# EAGLE design driver (EAGLE 9.6.1)
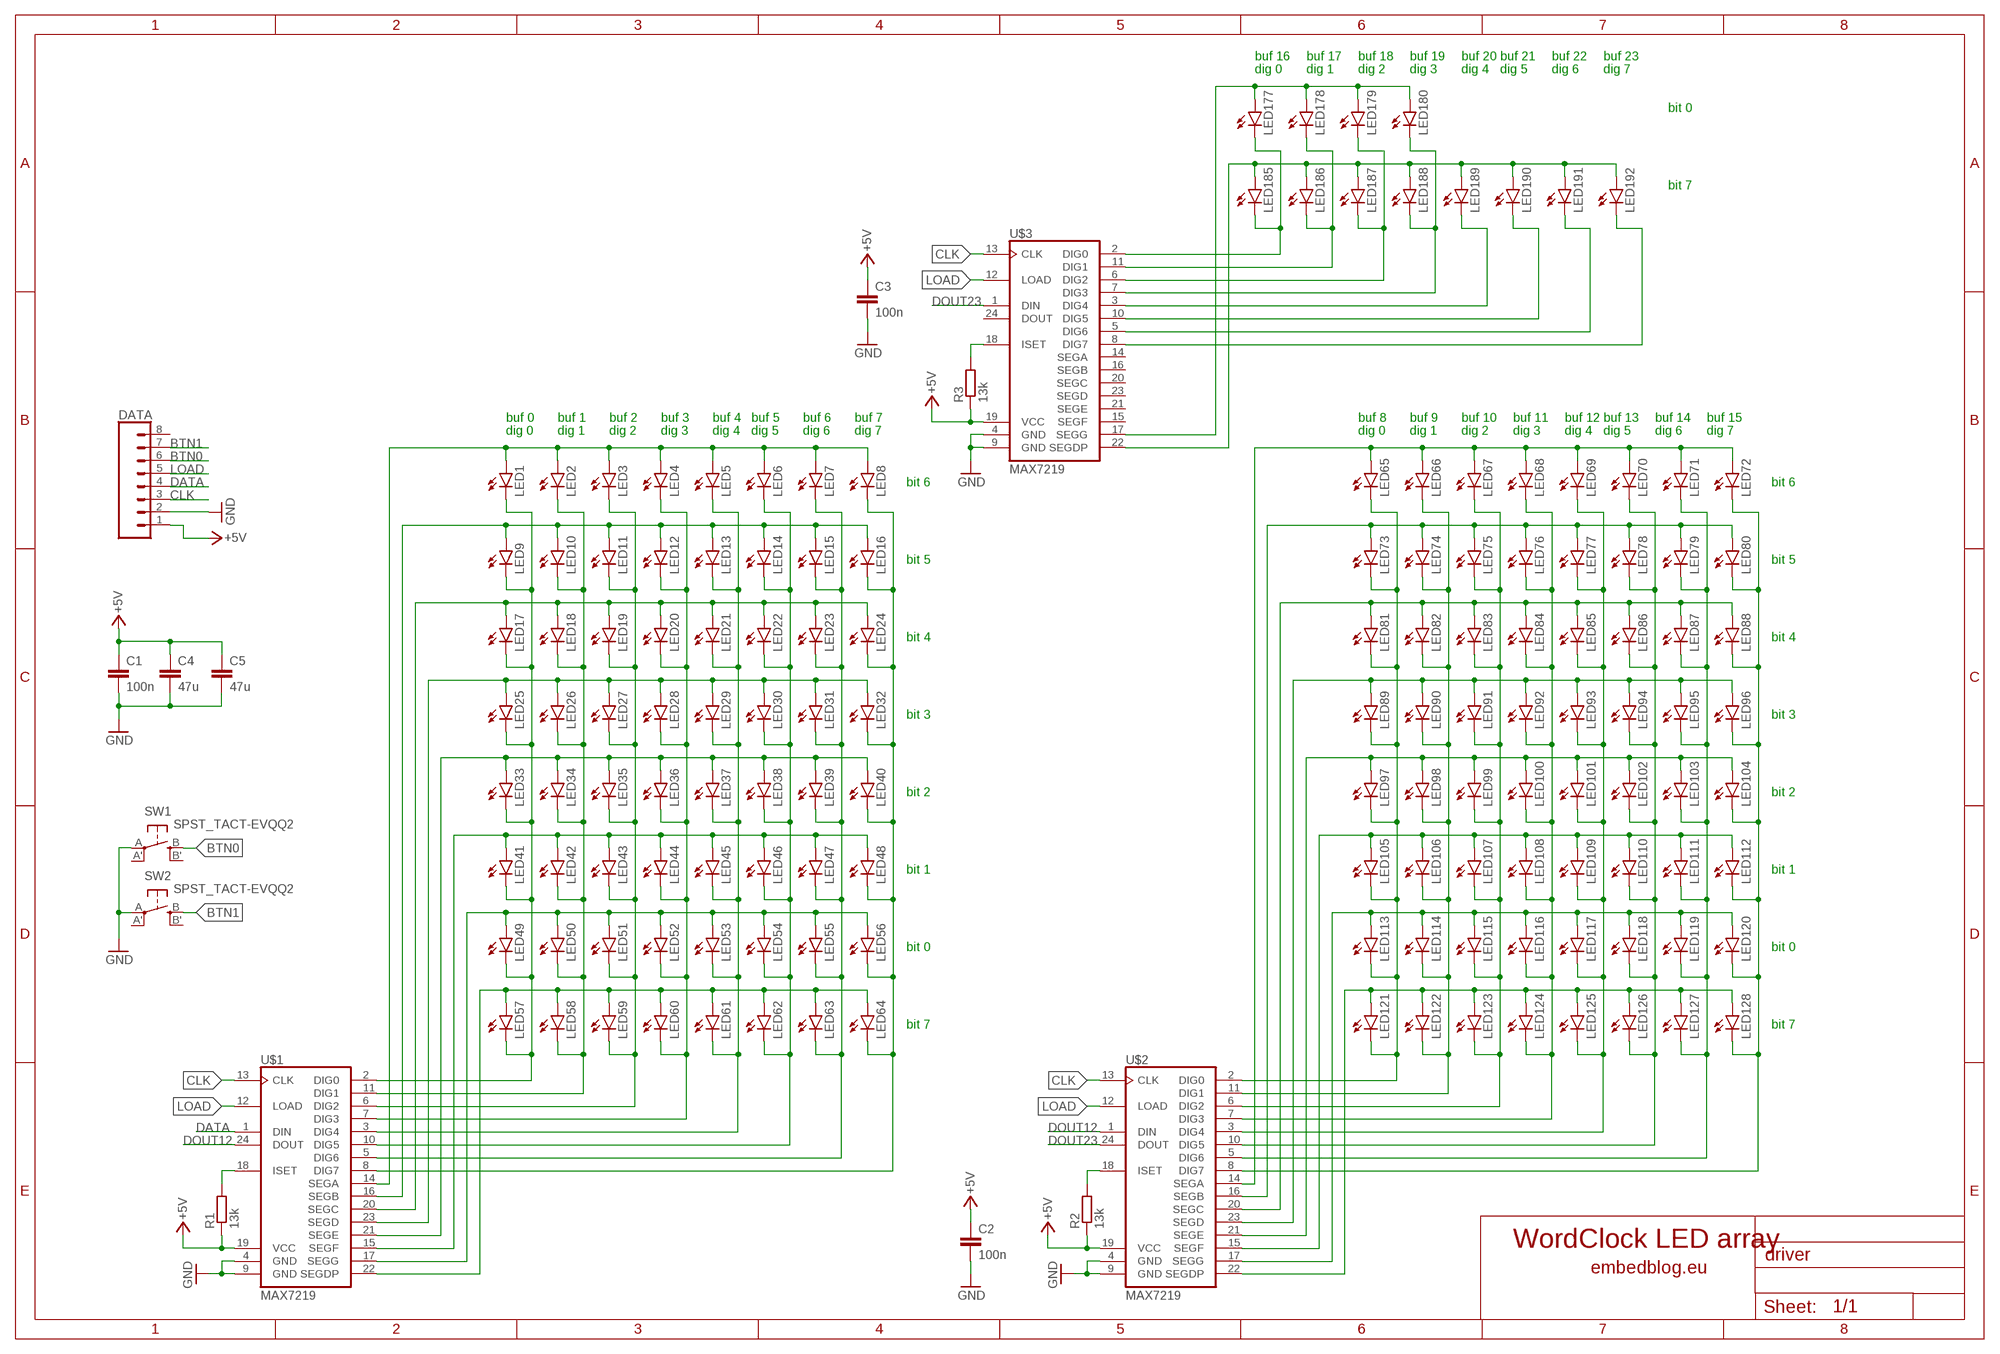
[diagram p0: schematic, sheet 1]

## Parts
C1  100n  C-EUC1206  [C1206]
C2  100n  C-EUC1206  [C1206]
C3  100n  C-EUC1206  [C1206]
C4  47u  C-EUC1206  [C1206]
C5  47u  C-EUC1206  [C1206]
DATA  CONN_08"  [1X08]
LED1  LEDCHIPLED_1206  [CHIPLED_1206]
LED2  LEDCHIPLED_1206  [CHIPLED_1206]
LED3  LEDCHIPLED_1206  [CHIPLED_1206]
LED4  LEDCHIPLED_1206  [CHIPLED_1206]
LED5  LEDCHIPLED_1206  [CHIPLED_1206]
LED6  LEDCHIPLED_1206  [CHIPLED_1206]
LED7  LEDCHIPLED_1206  [CHIPLED_1206]
LED8  LEDCHIPLED_1206  [CHIPLED_1206]
LED9  LEDCHIPLED_1206  [CHIPLED_1206]
LED10  LEDCHIPLED_1206  [CHIPLED_1206]
LED11  LEDCHIPLED_1206  [CHIPLED_1206]
LED12  LEDCHIPLED_1206  [CHIPLED_1206]
LED13  LEDCHIPLED_1206  [CHIPLED_1206]
LED14  LEDCHIPLED_1206  [CHIPLED_1206]
LED15  LEDCHIPLED_1206  [CHIPLED_1206]
LED16  LEDCHIPLED_1206  [CHIPLED_1206]
LED17  LEDCHIPLED_1206  [CHIPLED_1206]
LED18  LEDCHIPLED_1206  [CHIPLED_1206]
LED19  LEDCHIPLED_1206  [CHIPLED_1206]
LED20  LEDCHIPLED_1206  [CHIPLED_1206]
LED21  LEDCHIPLED_1206  [CHIPLED_1206]
LED22  LEDCHIPLED_1206  [CHIPLED_1206]
LED23  LEDCHIPLED_1206  [CHIPLED_1206]
LED24  LEDCHIPLED_1206  [CHIPLED_1206]
LED25  LEDCHIPLED_1206  [CHIPLED_1206]
LED26  LEDCHIPLED_1206  [CHIPLED_1206]
LED27  LEDCHIPLED_1206  [CHIPLED_1206]
LED28  LEDCHIPLED_1206  [CHIPLED_1206]
LED29  LEDCHIPLED_1206  [CHIPLED_1206]
LED30  LEDCHIPLED_1206  [CHIPLED_1206]
LED31  LEDCHIPLED_1206  [CHIPLED_1206]
LED32  LEDCHIPLED_1206  [CHIPLED_1206]
LED33  LEDCHIPLED_1206  [CHIPLED_1206]
LED34  LEDCHIPLED_1206  [CHIPLED_1206]
LED35  LEDCHIPLED_1206  [CHIPLED_1206]
LED36  LEDCHIPLED_1206  [CHIPLED_1206]
LED37  LEDCHIPLED_1206  [CHIPLED_1206]
LED38  LEDCHIPLED_1206  [CHIPLED_1206]
LED39  LEDCHIPLED_1206  [CHIPLED_1206]
LED40  LEDCHIPLED_1206  [CHIPLED_1206]
LED41  LEDCHIPLED_1206  [CHIPLED_1206]
LED42  LEDCHIPLED_1206  [CHIPLED_1206]
LED43  LEDCHIPLED_1206  [CHIPLED_1206]
LED44  LEDCHIPLED_1206  [CHIPLED_1206]
LED45  LEDCHIPLED_1206  [CHIPLED_1206]
LED46  LEDCHIPLED_1206  [CHIPLED_1206]
LED47  LEDCHIPLED_1206  [CHIPLED_1206]
LED48  LEDCHIPLED_1206  [CHIPLED_1206]
LED49  LEDCHIPLED_1206  [CHIPLED_1206]
LED50  LEDCHIPLED_1206  [CHIPLED_1206]
LED51  LEDCHIPLED_1206  [CHIPLED_1206]
LED52  LEDCHIPLED_1206  [CHIPLED_1206]
LED53  LEDCHIPLED_1206  [CHIPLED_1206]
LED54  LEDCHIPLED_1206  [CHIPLED_1206]
LED55  LEDCHIPLED_1206  [CHIPLED_1206]
LED56  LEDCHIPLED_1206  [CHIPLED_1206]
LED57  LEDCHIPLED_1206  [CHIPLED_1206]
LED58  LEDCHIPLED_1206  [CHIPLED_1206]
LED59  LEDCHIPLED_1206  [CHIPLED_1206]
LED60  LEDCHIPLED_1206  [CHIPLED_1206]
LED61  LEDCHIPLED_1206  [CHIPLED_1206]
LED62  LEDCHIPLED_1206  [CHIPLED_1206]
LED63  LEDCHIPLED_1206  [CHIPLED_1206]
LED64  LEDCHIPLED_1206  [CHIPLED_1206]
LED65  LEDCHIPLED_1206  [CHIPLED_1206]
LED66  LEDCHIPLED_1206  [CHIPLED_1206]
LED67  LEDCHIPLED_1206  [CHIPLED_1206]
LED68  LEDCHIPLED_1206  [CHIPLED_1206]
LED69  LEDCHIPLED_1206  [CHIPLED_1206]
LED70  LEDCHIPLED_1206  [CHIPLED_1206]
LED71  LEDCHIPLED_1206  [CHIPLED_1206]
LED72  LEDCHIPLED_1206  [CHIPLED_1206]
LED73  LEDCHIPLED_1206  [CHIPLED_1206]
LED74  LEDCHIPLED_1206  [CHIPLED_1206]
LED75  LEDCHIPLED_1206  [CHIPLED_1206]
LED76  LEDCHIPLED_1206  [CHIPLED_1206]
LED77  LEDCHIPLED_1206  [CHIPLED_1206]
LED78  LEDCHIPLED_1206  [CHIPLED_1206]
LED79  LEDCHIPLED_1206  [CHIPLED_1206]
LED80  LEDCHIPLED_1206  [CHIPLED_1206]
LED81  LEDCHIPLED_1206  [CHIPLED_1206]
LED82  LEDCHIPLED_1206  [CHIPLED_1206]
LED83  LEDCHIPLED_1206  [CHIPLED_1206]
LED84  LEDCHIPLED_1206  [CHIPLED_1206]
LED85  LEDCHIPLED_1206  [CHIPLED_1206]
LED86  LEDCHIPLED_1206  [CHIPLED_1206]
LED87  LEDCHIPLED_1206  [CHIPLED_1206]
LED88  LEDCHIPLED_1206  [CHIPLED_1206]
LED89  LEDCHIPLED_1206  [CHIPLED_1206]
LED90  LEDCHIPLED_1206  [CHIPLED_1206]
LED91  LEDCHIPLED_1206  [CHIPLED_1206]
LED92  LEDCHIPLED_1206  [CHIPLED_1206]
LED93  LEDCHIPLED_1206  [CHIPLED_1206]
LED94  LEDCHIPLED_1206  [CHIPLED_1206]
LED95  LEDCHIPLED_1206  [CHIPLED_1206]
LED96  LEDCHIPLED_1206  [CHIPLED_1206]
LED97  LEDCHIPLED_1206  [CHIPLED_1206]
LED98  LEDCHIPLED_1206  [CHIPLED_1206]
LED99  LEDCHIPLED_1206  [CHIPLED_1206]
LED100  LEDCHIPLED_1206  [CHIPLED_1206]
LED101  LEDCHIPLED_1206  [CHIPLED_1206]
LED102  LEDCHIPLED_1206  [CHIPLED_1206]
LED103  LEDCHIPLED_1206  [CHIPLED_1206]
LED104  LEDCHIPLED_1206  [CHIPLED_1206]
LED105  LEDCHIPLED_1206  [CHIPLED_1206]
LED106  LEDCHIPLED_1206  [CHIPLED_1206]
LED107  LEDCHIPLED_1206  [CHIPLED_1206]
LED108  LEDCHIPLED_1206  [CHIPLED_1206]
LED109  LEDCHIPLED_1206  [CHIPLED_1206]
LED110  LEDCHIPLED_1206  [CHIPLED_1206]
LED111  LEDCHIPLED_1206  [CHIPLED_1206]
LED112  LEDCHIPLED_1206  [CHIPLED_1206]
LED113  LEDCHIPLED_1206  [CHIPLED_1206]
LED114  LEDCHIPLED_1206  [CHIPLED_1206]
LED115  LEDCHIPLED_1206  [CHIPLED_1206]
LED116  LEDCHIPLED_1206  [CHIPLED_1206]
LED117  LEDCHIPLED_1206  [CHIPLED_1206]
LED118  LEDCHIPLED_1206  [CHIPLED_1206]
LED119  LEDCHIPLED_1206  [CHIPLED_1206]
LED120  LEDCHIPLED_1206  [CHIPLED_1206]
LED121  LEDCHIPLED_1206  [CHIPLED_1206]
LED122  LEDCHIPLED_1206  [CHIPLED_1206]
LED123  LEDCHIPLED_1206  [CHIPLED_1206]
LED124  LEDCHIPLED_1206  [CHIPLED_1206]
LED125  LEDCHIPLED_1206  [CHIPLED_1206]
LED126  LEDCHIPLED_1206  [CHIPLED_1206]
LED127  LEDCHIPLED_1206  [CHIPLED_1206]
LED128  LEDCHIPLED_1206  [CHIPLED_1206]
LED177  LEDCHIPLED_1206  [CHIPLED_1206]
LED178  LEDCHIPLED_1206  [CHIPLED_1206]
LED179  LEDCHIPLED_1206  [CHIPLED_1206]
LED180  LEDCHIPLED_1206  [CHIPLED_1206]
LED185  LEDCHIPLED_1206  [CHIPLED_1206]
LED186  LEDCHIPLED_1206  [CHIPLED_1206]
LED187  LEDCHIPLED_1206  [CHIPLED_1206]
LED188  LEDCHIPLED_1206  [CHIPLED_1206]
LED189  LEDCHIPLED_1206  [CHIPLED_1206]
LED190  LEDCHIPLED_1206  [CHIPLED_1206]
LED191  LEDCHIPLED_1206  [CHIPLED_1206]
LED192  LEDCHIPLED_1206  [CHIPLED_1206]
R1  13k  R-EU_R1206  [R1206]
R2  13k  R-EU_R1206  [R1206]
R3  13k  R-EU_R1206  [R1206]
SW1  SPST_TACT-EVQQ2  [EVQ-Q2]
SW2  SPST_TACT-EVQQ2  [EVQ-Q2]
U$1  MAX7219  [SO24W]
U$2  MAX7219  [SO24W]
U$3  MAX7219  [SO24W]

## Nets
+5V: C1.1 C2.1 C3.1 C4.1 C5.1 DATA.1 R1.1 R2.1 R3.1 U$1.19(VCC) U$2.19(VCC) U$3.19(VCC)
BTN0: DATA.6 SW1.B(S)
BTN1: DATA.7 SW2.B(S)
CLK: DATA.3 U$1.13(CLK) U$2.13(CLK) U$3.13(CLK)
DATA: DATA.4 U$1.1(DIN)
DOUT12: U$1.24(DOUT) U$2.1(DIN)
DOUT23: U$2.24(DOUT) U$3.1(DIN)
GND: C1.2 C2.2 C3.2 C4.2 C5.2 DATA.2 SW1.A(P) SW2.A(P) U$1.4(GND) U$1.9(GND) U$2.4(GND) U$2.9(GND) U$3.4(GND) U$3.9(GND)
LOAD: DATA.5 U$1.12(LOAD) U$2.12(LOAD) U$3.12(LOAD)
N$1: LED1.A LED2.A LED3.A LED4.A LED5.A LED6.A LED7.A LED8.A U$1.14(SEGA)
N$2: LED25.A LED26.A LED27.A LED28.A LED29.A LED30.A LED31.A LED32.A U$1.23(SEGD)
N$3: LED9.A LED10.A LED11.A LED12.A LED13.A LED14.A LED15.A LED16.A U$1.16(SEGB)
N$4: LED17.A LED18.A LED19.A LED20.A LED21.A LED22.A LED23.A LED24.A U$1.20(SEGC)
N$5: LED33.A LED34.A LED35.A LED36.A LED37.A LED38.A LED39.A LED40.A U$1.21(SEGE)
N$6: LED41.A LED42.A LED43.A LED44.A LED45.A LED46.A LED47.A LED48.A U$1.15(SEGF)
N$7: LED49.A LED50.A LED51.A LED52.A LED53.A LED54.A LED55.A LED56.A U$1.17(SEGG)
N$8: LED57.A LED58.A LED59.A LED60.A LED61.A LED62.A LED63.A LED64.A U$1.22(SEGDP)
N$9: LED1.C LED9.C LED17.C LED25.C LED33.C LED41.C LED49.C LED57.C U$1.2(DIG0)
N$10: R1.2 U$1.18(ISET)
N$11: LED65.A LED66.A LED67.A LED68.A LED69.A LED70.A LED71.A LED72.A U$2.14(SEGA)
N$12: LED73.A LED74.A LED75.A LED76.A LED77.A LED78.A LED79.A LED80.A U$2.16(SEGB)
N$13: LED81.A LED82.A LED83.A LED84.A LED85.A LED86.A LED87.A LED88.A U$2.20(SEGC)
N$14: LED89.A LED90.A LED91.A LED92.A LED93.A LED94.A LED95.A LED96.A U$2.23(SEGD)
N$15: LED97.A LED98.A LED99.A LED100.A LED101.A LED102.A LED103.A LED104.A U$2.21(SEGE)
N$16: LED105.A LED106.A LED107.A LED108.A LED109.A LED110.A LED111.A LED112.A U$2.15(SEGF)
N$17: LED2.C LED10.C LED18.C LED26.C LED34.C LED42.C LED50.C LED58.C U$1.11(DIG1)
N$18: LED113.A LED114.A LED115.A LED116.A LED117.A LED118.A LED119.A LED120.A U$2.17(SEGG)
N$19: LED121.A LED122.A LED123.A LED124.A LED125.A LED126.A LED127.A LED128.A U$2.22(SEGDP)
N$20: LED65.C LED73.C LED81.C LED89.C LED97.C LED105.C LED113.C LED121.C U$2.2(DIG0)
N$21: LED66.C LED74.C LED82.C LED90.C LED98.C LED106.C LED114.C LED122.C U$2.11(DIG1)
N$22: LED67.C LED75.C LED83.C LED91.C LED99.C LED107.C LED115.C LED123.C U$2.6(DIG2)
N$23: LED68.C LED76.C LED84.C LED92.C LED100.C LED108.C LED116.C LED124.C U$2.7(DIG3)
N$24: LED69.C LED77.C LED85.C LED93.C LED101.C LED109.C LED117.C LED125.C U$2.3(DIG4)
N$25: LED3.C LED11.C LED19.C LED27.C LED35.C LED43.C LED51.C LED59.C U$1.6(DIG2)
N$26: LED70.C LED78.C LED86.C LED94.C LED102.C LED110.C LED118.C LED126.C U$2.10(DIG5)
N$27: LED71.C LED79.C LED87.C LED95.C LED103.C LED111.C LED119.C LED127.C U$2.5(DIG6)
N$28: LED72.C LED80.C LED88.C LED96.C LED104.C LED112.C LED120.C LED128.C U$2.8(DIG7)
N$29: R2.2 U$2.18(ISET)
N$33: LED4.C LED12.C LED20.C LED28.C LED36.C LED44.C LED52.C LED60.C U$1.7(DIG3)
N$37: LED177.A LED178.A LED179.A LED180.A U$3.17(SEGG)
N$38: LED185.A LED186.A LED187.A LED188.A LED189.A LED190.A LED191.A LED192.A U$3.22(SEGDP)
N$39: LED177.C LED185.C U$3.2(DIG0)
N$40: LED178.C LED186.C U$3.11(DIG1)
N$41: LED5.C LED13.C LED21.C LED29.C LED37.C LED45.C LED53.C LED61.C U$1.3(DIG4)
N$42: LED179.C LED187.C U$3.6(DIG2)
N$43: LED180.C LED188.C U$3.7(DIG3)
N$44: LED189.C U$3.3(DIG4)
N$45: LED190.C U$3.10(DIG5)
N$46: LED191.C U$3.5(DIG6)
N$47: LED192.C U$3.8(DIG7)
N$48: R3.2 U$3.18(ISET)
N$49: LED6.C LED14.C LED22.C LED30.C LED38.C LED46.C LED54.C LED62.C U$1.10(DIG5)
N$57: LED7.C LED15.C LED23.C LED31.C LED39.C LED47.C LED55.C LED63.C U$1.5(DIG6)
N$65: LED8.C LED16.C LED24.C LED32.C LED40.C LED48.C LED56.C LED64.C U$1.8(DIG7)
Unconnected: DATA.8 SW1.A'(P1) SW1.B'(S1) SW2.A'(P1) SW2.B'(S1) U$3.14(SEGA) U$3.15(SEGF) U$3.16(SEGB) U$3.20(SEGC) U$3.21(SEGE) U$3.23(SEGD) U$3.24(DOUT)

## Notes on the sheet
- buf 16 | buf 17 | buf 18 | buf 19 | buf 20 | buf 21 | buf 22 | buf 23
- dig 0 | dig 1 | dig 2 | dig 3 | dig 4 | dig 5 | dig 6 | dig 7
- bit 0
- bit 7
- buf 0 | buf 1 | buf 2 | buf 3 | buf 4 | buf 5 | buf 6 | buf 7 | buf 8 | buf 9 | buf 10 | buf 11 | buf 12 | buf 13 | buf 14 | buf 15
- dig 0 | dig 1 | dig 2 | dig 3 | dig 4 | dig 5 | dig 6 | dig 7 | dig 0 | dig 1 | dig 2 | dig 3 | dig 4 | dig 5 | dig 6 | dig 7
- bit 6 | bit 6
- bit 5 | bit 5
- bit 4 | bit 4
- bit 3 | bit 3
- bit 2 | bit 2
- bit 1 | bit 1
- bit 0 | bit 0
- bit 7 | bit 7
- WordClock LED array
- embedblog.eu

## Library data of the parts
C1-C5 = resistor:C-EU: CAPACITOR, European symbol
DATA = SparkFun-Connectors:CONN_08: Multi connection point. Often used as Generic Header-pin footprint for 0.1 inch spaced/style header connections On any of the 0.1 inch spaced packages, you can populate with these: Break Away Headers - Straight <https://www.sparkfun.com/products/116> (PRT-00116) Break Away Male Headers - Right Angle <https://www.sparkfun.com/products/553> (PRT-00553) Female Headers <https://www.sparkfun.com/products/115> (PRT-00115) Break Away Headers - Machine Pin <https://www.sparkfun.com/products/117> (PRT-00117) Break Away Female Headers - Swiss Machine Pin <https://www.sparkfun.com/products/743> (PRT-00743) Arduino Stackable Header - 8 Pin <https://www.sparkfun.com/products/9279> (PRT-09279) For SCREWTERMINALS and SPRING TERMINALS visit here: Screw Terimnals on SparkFun.com <https://www.sparkfun.com/search/results?term=Screw+Terminals> (5mm/3.5mm/2.54mm spacing) This device is also useful as a general connection point to wire up your design to another part of your project. Our various solder wires solder well into these plated through hole pads. Hook-Up Wire - Assortment (Stranded, 22 AWG) <https://www.sparkfun.com/products/11375> (PRT-11375) Hook-Up Wire - Assortment (Solid Core, 22 AWG) <https://www.sparkfun.com/products/11367> (PRT-11367) View the entire wire category on our website here <https://www.sparkfun.com/categories/141> Special notes: Molex polarized connector foot print use with SKU : PRT-08231 with associated crimp pins and housings. 1MM SMD Version SKU: PRT-10208 NOTES ON THE VARIANTS LOCK and LOCK_LONGPADS... This footprint was designed to help hold the alignment of a through-hole component (i.e. 6-pin header) while soldering it into place. You may notice that each hole has been shifted either up or down by 0.005 of an inch from it's more standard position (which is a perfectly straight line). This slight alteration caused the pins (the squares in the middle) to touch the edges of the holes. Because they are alternating, it causes a "brace" to hold the component in place. 0.005 has proven to be the perfect amount of "off-center" position when using our standard breakaway headers. Although looks a little odd when you look at the bare footprint, once you have a header in there, the alteration is very hard to notice. Also,if you push a header all the way into place, it is covered up entirely on the bottom side.; PROD_ID: CONN-08438
LED1-LED128 LED177-LED180 LED185-LED192 = led:LED: LED OSRAM: - CHIPLED LG R971, LG N971, LY N971, LG Q971, LY Q971, LO R971, LY R971 LH N974, LH R974 LS Q976, LO Q976, LY Q976 LO Q996 - Hyper CHIPLED LW Q18S LB Q993, LB Q99A, LB R99A - SideLED LS A670, LO A670, LY A670, LG A670, LP A670 LB A673, LV A673, LT A673, LW A673 LH A674 LY A675 LS A676, LA A676, LO A676, LY A676, LW A676 LS A679, LY A679, LG A679 - Hyper Micro SIDELED® LS Y876, LA Y876, LO Y876, LY Y876 LT Y87S - SmartLED LW L88C, LW L88S LB L89C, LB L89S, LG L890 LS L89K, LO L89K, LY L89K LS L896, LA L896, LO L896, LY L896 - TOPLED LS T670, LO T670, LY T670, LG T670, LP T670 LSG T670, LSP T670, LSY T670, LOP T670, LYG T670 LG T671, LOG T671, LSG T671 LB T673, LV T673, LT T673, LW T673 LH T674 LS T676, LA T676, LO T676, LY T676, LB T676, LH T676, LSB T676, LW T676 LB T67C, LV T67C, LT T67C, LS T67K, LO T67K, LY T67K, LW E67C LS E67B, LA E67B, LO E67B, LY E67B, LB E67C, LV E67C, LT E67C LW T67C LS T679, LY T679, LG T679 LS T770, LO T770, LY T770, LG T770, LP T770 LB T773, LV T773, LT T773, LW T773 LH T774 LS E675, LA E675, LY E675, LS T675 LS T776, LA T776, LO T776, LY T776, LB T776 LHGB T686 LT T68C, LB T68C - Hyper Mini TOPLED® LB M676 - Mini TOPLED Santana® LG M470 LS M47K, LO M47K, LY M47K Source: http://www.osram.convergy.de LUXEON: - LUMILED® LXK2-PW12-R00, LXK2-PW12-S00, LXK2-PW14-U00, LXK2-PW14-V00 LXK2-PM12-R00, LXK2-PM12-S00, LXK2-PM14-U00 LXK2-PE12-Q00, LXK2-PE12-R00, LXK2-PE12-S00, LXK2-PE14-T00, LXK2-PE14-U00 LXK2-PB12-K00, LXK2-PB12-L00, LXK2-PB12-M00, LXK2-PB14-N00, LXK2-PB14-P00, LXK2-PB14-Q00 LXK2-PR12-L00, LXK2-PR12-M00, LXK2-PR14-Q00, LXK2-PR14-R00 LXK2-PD12-Q00, LXK2-PD12-R00, LXK2-PD12-S00 LXK2-PH12-R00, LXK2-PH12-S00 LXK2-PL12-P00, LXK2-PL12-Q00, LXK2-PL12-R00 Source: www.luxeon.com KINGBRIGHT: KA-3528ASYC Source: www.kingbright.com
R1-R3 = resistor:R-EU_: RESISTOR, European symbol
SW1 SW2 = adafruit:SPST_TACT: SMT 6mm switch, EVQQ2 series http://www.ladyada.net/library/eagle
U$1-U$3 = custom:MAX7219

## Board
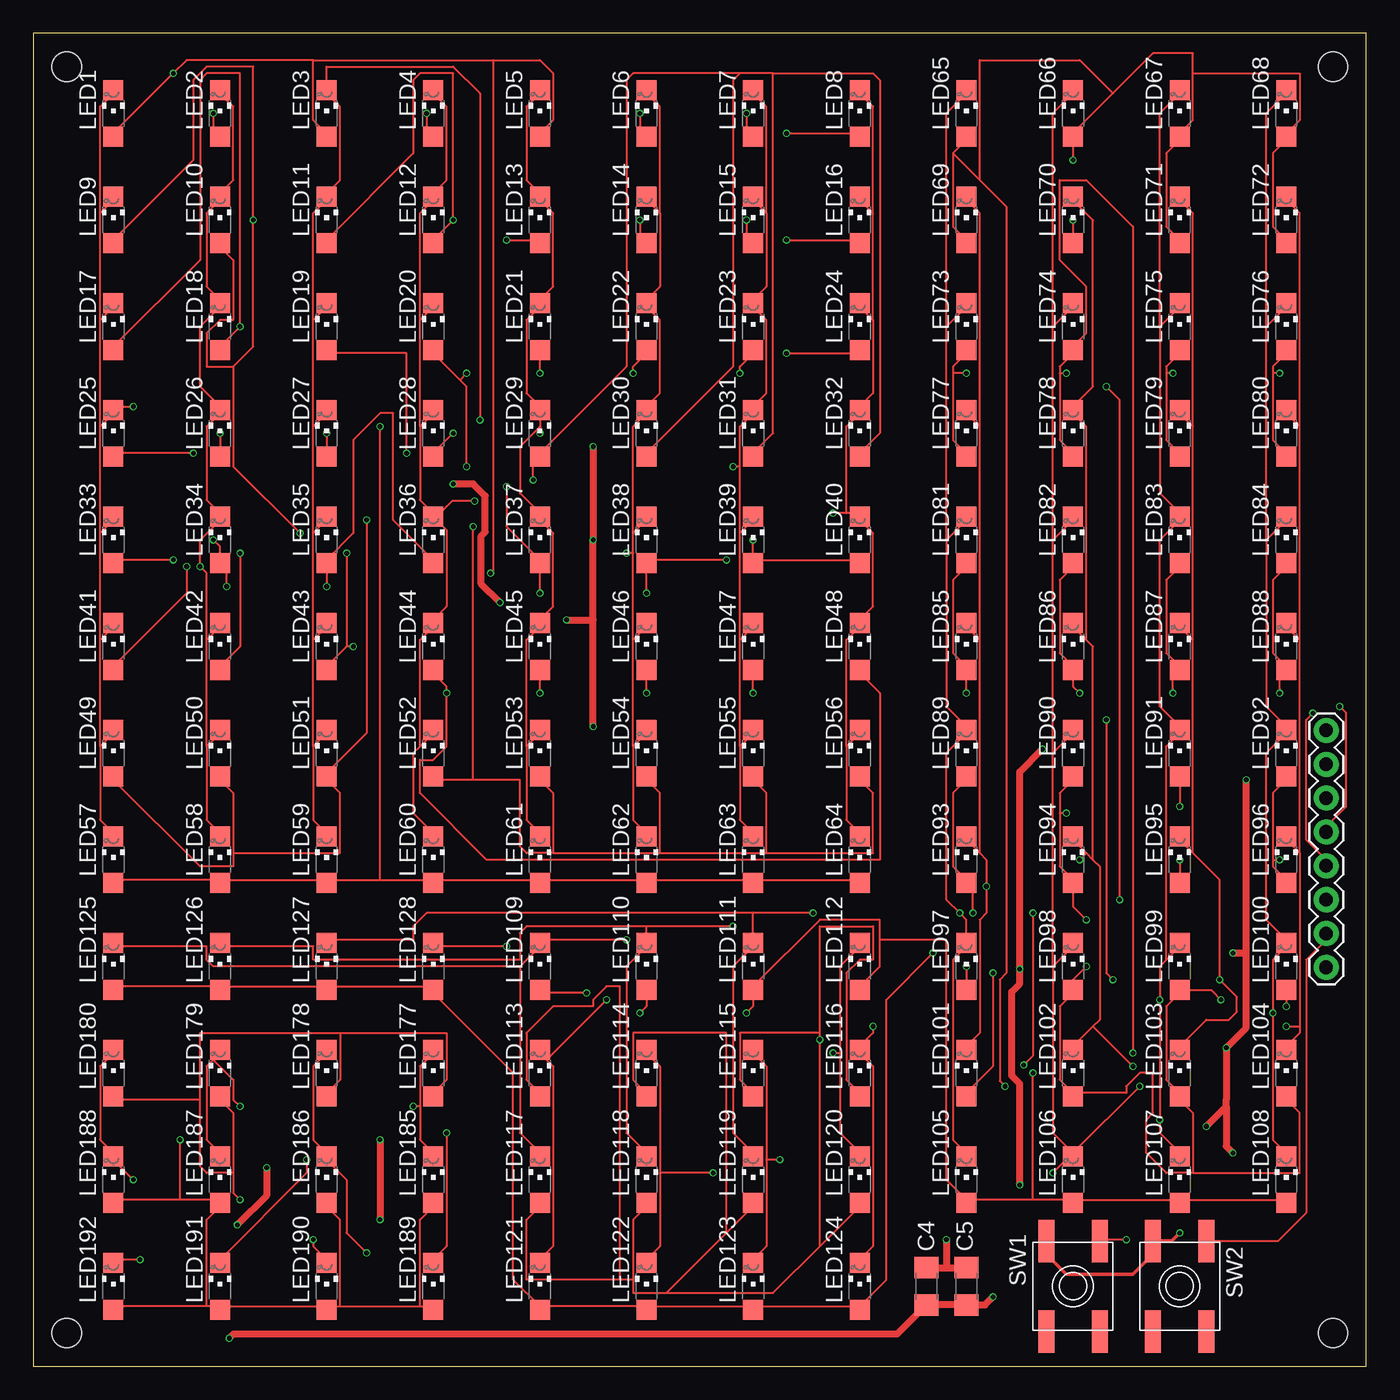
[diagram p1: board, top side]
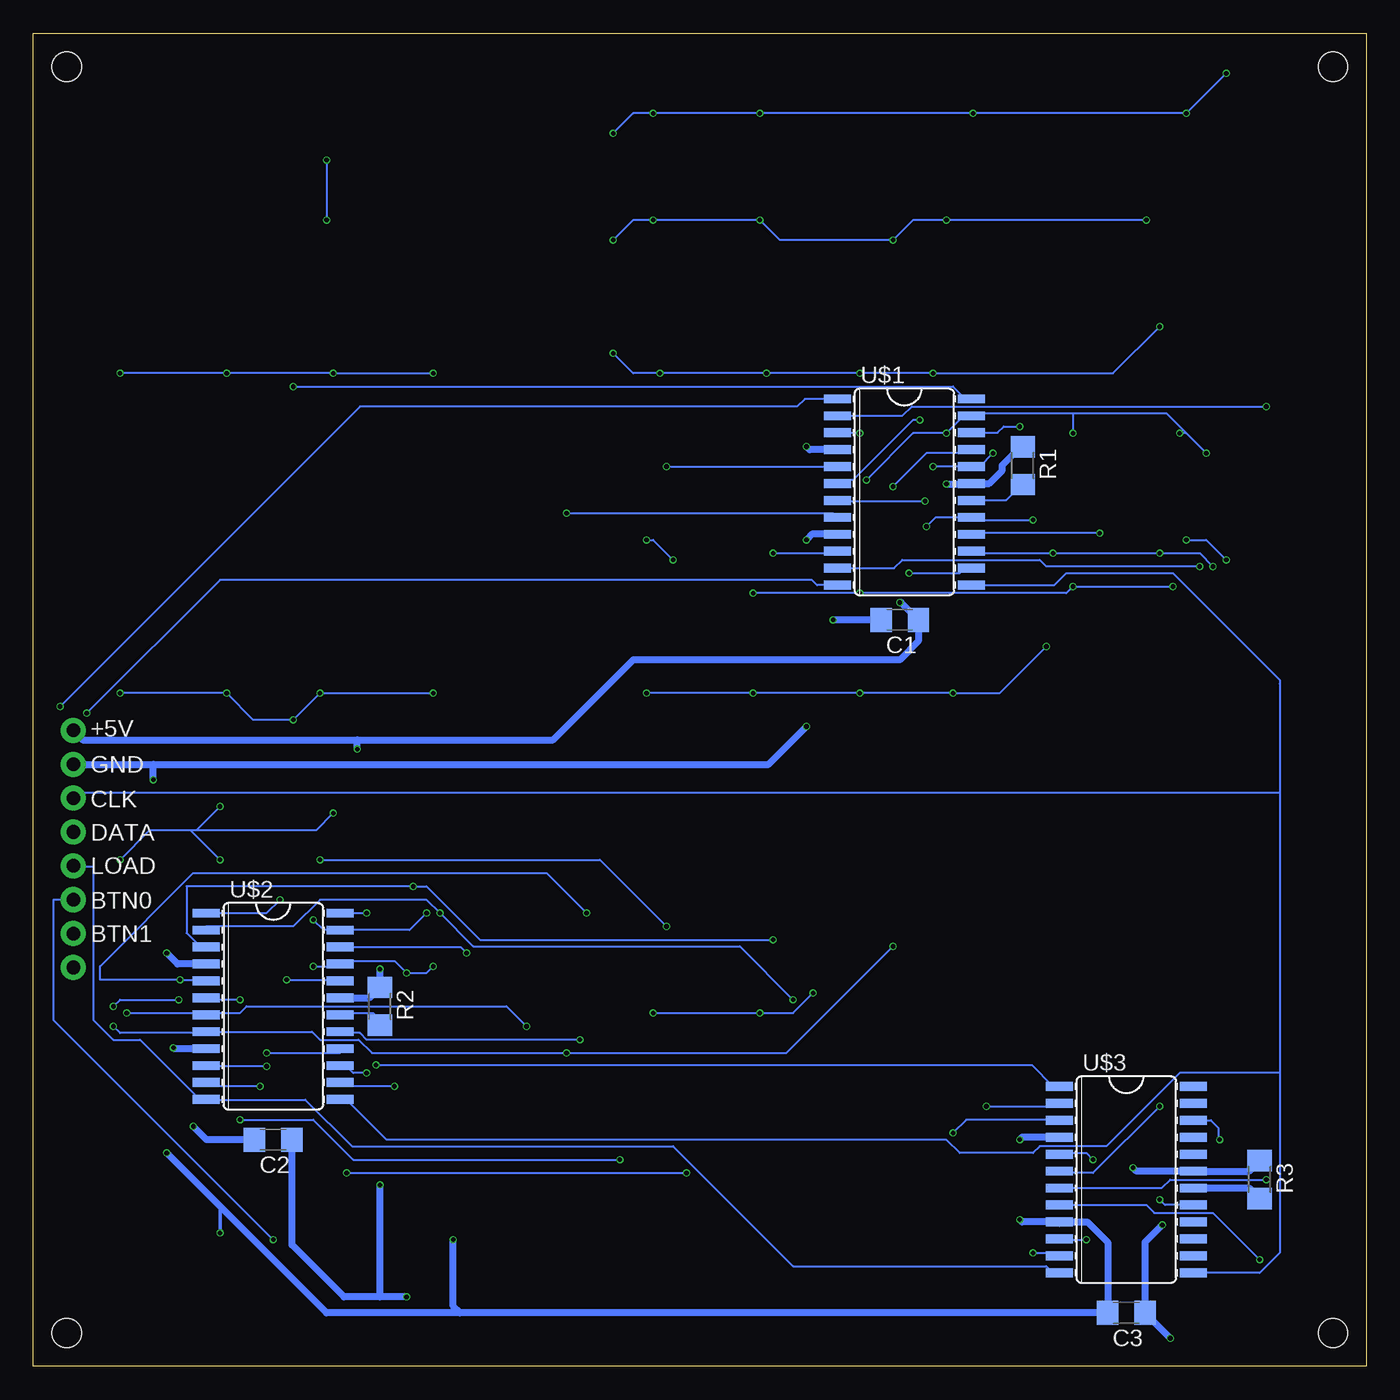
[diagram p2: board, bottom side, seen from below]

Size 100 x 100 mm. Coordinates in mm from the lower left corner, seen from the top.
Outline: 0,0 100,0 100,100 0,100 0,0
Copper layers (1*16): Top 0.035mm / dielectric 1.2mm / Bottom 0.035mm
Design rules "JLCPCB": minimum track width 5mil, minimum drill 0.3mm, track to track 5mil, track to pad 5mil, pad to pad 5mil, via to via 5mil, smd to smd 5mil, copper to edge 0.2mm, drill to drill 6mil, minimum pad ring 3mil, minimum via ring 3mil, stop-mask expansion 4mil, vias tented up to drill 0mil, thermal gap 10mil
Holes 2.2 mm at 2.5,2.5 97.5,2.5 97.5,97.5 2.5,97.5

### Footprints (pad centres in the part's own frame; a part is rotated, then mirrored left to right if it is on the bottom)
C1206 = smd 1.6 x 1.8: 1 -1.4,0; 2 1.4,0
1X08 = drill 1.016 pad 1.88: 1 0,0; 2 2.54,0; 3 5.08,0; 4 7.62,0; 5 10.16,0; 6 12.7,0; 7 15.24,0; 8 17.78,0
CHIPLED_1206 = smd 1.5 x 1.5: A 0,-1.75; C 0,1.75
R1206 = smd 1.6 x 1.803: 1 -1.422,0; 2 1.422,0
EVQ-Q2 = smd 3.2 x 1.2: A -3.4,-2; A' 3.4,-2; B -3.4,2; B' 3.4,2
SO24W = smd 0.66 x 2.032: 1 -6.985,-5.029; 2 -5.715,-5.029; 3 -4.445,-5.029; 4 -3.175,-5.029; 5 -1.905,-5.029; 6 -0.635,-5.029; 7 0.635,-5.029; 8 1.905,-5.029; 9 3.175,-5.029; 10 4.445,-5.029; 11 5.715,-5.029; 12 6.985,-5.029; 13 6.985,5.029; 14 5.715,5.029; 15 4.445,5.029; 16 3.175,5.029; 17 1.905,5.029; 18 0.635,5.029; 19 -0.635,5.029; 20 -1.905,5.029; 21 -3.175,5.029; 22 -4.445,5.029; 23 -5.715,5.029; 24 -6.985,5.029

### Placement (x,y rotation side)
C1  35,56 180 bottom
C2  82,17 180 bottom
C3  18,4 180 bottom
C4  67,6 90 top
C5  70,6 90 top
DATA  97,47.7 270 top
LED1  6,94 0 top
LED2  14,94 0 top
LED3  22,94 0 top
LED4  30,94 0 top
LED5  38,94 0 top
LED6  46,94 0 top
LED7  54,94 0 top
LED8  62,94 0 top
LED9  6,86 0 top
LED10  14,86 0 top
LED11  22,86 0 top
LED12  30,86 0 top
LED13  38,86 0 top
LED14  46,86 0 top
LED15  54,86 0 top
LED16  62,86 0 top
LED17  6,78 0 top
LED18  14,78 0 top
LED19  22,78 0 top
LED20  30,78 0 top
LED21  38,78 0 top
LED22  46,78 0 top
LED23  54,78 0 top
LED24  62,78 0 top
LED25  6,70 0 top
LED26  14,70 0 top
LED27  22,70 0 top
LED28  30,70 0 top
LED29  38,70 0 top
LED30  46,70 0 top
LED31  54,70 0 top
LED32  62,70 0 top
LED33  6,62 0 top
LED34  14,62 0 top
LED35  22,62 0 top
LED36  30,62 0 top
LED37  38,62 0 top
LED38  46,62 0 top
LED39  54,62 0 top
LED40  62,62 0 top
LED41  6,54 0 top
LED42  14,54 0 top
LED43  22,54 0 top
LED44  30,54 0 top
LED45  38,54 0 top
LED46  46,54 0 top
LED47  54,54 0 top
LED48  62,54 0 top
LED49  6,46 0 top
LED50  14,46 0 top
LED51  22,46 0 top
LED52  30,46 0 top
LED53  38,46 0 top
LED54  46,46 0 top
LED55  54,46 0 top
LED56  62,46 0 top
LED57  6,38 0 top
LED58  14,38 0 top
LED59  22,38 0 top
LED60  30,38 0 top
LED61  38,38 0 top
LED62  46,38 0 top
LED63  54,38 0 top
LED64  62,38 0 top
LED65  70,94 0 top
LED66  78,94 0 top
LED67  86,94 0 top
LED68  94,94 0 top
LED69  70,86 0 top
LED70  78,86 0 top
LED71  86,86 0 top
LED72  94,86 0 top
LED73  70,78 0 top
LED74  78,78 0 top
LED75  86,78 0 top
LED76  94,78 0 top
LED77  70,70 0 top
LED78  78,70 0 top
LED79  86,70 0 top
LED80  94,70 0 top
LED81  70,62 0 top
LED82  78,62 0 top
LED83  86,62 0 top
LED84  94,62 0 top
LED85  70,54 0 top
LED86  78,54 0 top
LED87  86,54 0 top
LED88  94,54 0 top
LED89  70,46 0 top
LED90  78,46 0 top
LED91  86,46 0 top
LED92  94,46 0 top
LED93  70,38 0 top
LED94  78,38 0 top
LED95  86,38 0 top
LED96  94,38 0 top
LED97  70,30 0 top
LED98  78,30 0 top
LED99  86,30 0 top
LED100  94,30 0 top
LED101  70,22 0 top
LED102  78,22 0 top
LED103  86,22 0 top
LED104  94,22 0 top
LED105  70,14 0 top
LED106  78,14 0 top
LED107  86,14 0 top
LED108  94,14 0 top
LED109  38,30 0 top
LED110  46,30 0 top
LED111  54,30 0 top
LED112  62,30 0 top
LED113  38,22 0 top
LED114  46,22 0 top
LED115  54,22 0 top
LED116  62,22 0 top
LED117  38,14 0 top
LED118  46,14 0 top
LED119  54,14 0 top
LED120  62,14 0 top
LED121  38,6 0 top
LED122  46,6 0 top
LED123  54,6 0 top
LED124  62,6 0 top
LED125  6,30 0 top
LED126  14,30 0 top
LED127  22,30 0 top
LED128  30,30 0 top
LED177  30,22 0 top
LED178  22,22 0 top
LED179  14,22 0 top
LED180  6,22 0 top
LED185  30,14 0 top
LED186  22,14 0 top
LED187  14,14 0 top
LED188  6,14 0 top
LED189  30,6 0 top
LED190  22,6 0 top
LED191  14,6 0 top
LED192  6,6 0 top
R1  25.77,67.56 270 bottom
R2  74,27 270 bottom
R3  8,14 270 bottom
SW1  78,6 270 top
SW2  86,6 270 top
U$1  34.65,65.59 270 bottom
U$2  82,27 270 bottom
U$3  18,14 270 bottom

### Tracks (layer width: path | path; a pad name or v marks a point on that pad's centre or on a via)
+5V  (via drill 0.35)
  Top 0.152: 66.75,4.25 67,4.5 C4.1 | 70,4.5 C5.1 70,5
  Top 0.508: v35,57.3 33.6,58.7 33.6,62.3 33.9,62.6 33.9,65.3 33,66.2 v31.5,66.2 | v75.7,46.3 74,44.6 v74,29.8 74,28.7 73.4,28.1 73.4,21.8 74,21.2 v74,13.6 | 66.75,4.25 67.1,4.6 C5.1 71.4,4.6 v72,5.2 | C4.1 64.8,2.4 15,2.4 v14.7,2.1 | v17.5,14.9 17.5,12.8 v15.3,10.6
  Bottom 0.152: 34,56 C1.1 | 26,68.5 R1.1 25.5,68.5 | 29.5,66.5 U$1.19 30,66 30.5,66 | 8,15 R3.1 | 12.5,14.5 U$3.19 13,14.5 | 76.5,27.5 U$2.19 | 17,4 C3.1 | 80.5,17 C2.1 | 74,28 R2.1
  Bottom 0.508: DATA.1 96.3,47 75.7,47 | 75.7,47 61,47 55,53 35,53 33.6,54.4 C1.1 34.9,57.3 v35,57.3 | R1.1 25.92,68.98 27.3,67.6 27.3,67.2 28.27,66.22 U$1.19 29.65,66.2 v31.5,66.2 | U$2.19 74.79,27.64 R2.1 v74,29.8 | v75.7,46.3 75.7,47 | v14.7,2.1 C3.1 16.6,9.3 v15.3,10.6 | R3.1 8.79,14.63 U$3.19 17.23,14.63 v17.5,14.9 | v72,5.2 74,5.2 | 74,5.2 76.7,5.2 80.6,9.1 C2.1 | 74,5.2 v74,13.6
BTN0  (via drill 0.35)
  Top 0.152: v82,9.5 80,9.5 SW1.B
  Bottom 0.152: v82,9.5 98.5,26 98.5,35 DATA.6
BTN1
  Top 0.15: SW2.B 93.4,9.4 95.5,11.5
  Top 0.152: 95.5,11.5 95.5,30.5 97,32 DATA.7
CLK
  Bottom 0.15: 14,59 6.5,51.5 6.5,51.2 | U$1.13 23.39,58.6 22.5,59.5
  Bottom 0.152: 6.5,51.2 6.5,43 | 6.5,43 6.5,22 | 6.5,22 6.5,8.5 8,7 12.5,7 U$3.13 | 14,59 14.5,59.5 22.5,59.5 | 6.5,22 14,22 19.5,16.5 24.5,16.5 25,16 30.5,16 31.5,17 73.5,17 76.5,20 U$2.13 | 6.5,43 97,43 DATA.3
DATA  (via drill 0.35)
  Top 0.152: v98,49.5 98.5,49 98.5,42 97,40.5 DATA.4
  Bottom 0.15: U$1.1 42.12,72.58 42.7,72
  Bottom 0.152: 42.7,72 75.5,72 v98,49.5
DOUT12  (via drill 0.35)
  Top 0.152: v80.5,73.5 81.5,72.5 v81.5,35
  Bottom 0.152: v80.5,73.5 31,73.5 30,72.5 U$1.24 | v81.5,35 82.5,34 87,34 U$2.1
DOUT23  (via drill 0.35)
  Top 0.152: v74.3,22.6 75,23.3 v75,34
  Bottom 0.152: v74.3,22.6 25.1,22.6 23.5,21 U$3.1 | v75,34 76.5,34 U$2.24
GND  (via drill 0.35)
  Top 0.152: 67,7.5 C4.2 | SW1.A 76,10 | 70,7.5 C5.2
  Top 0.254: SW1.A 76,8.4 77.5,6.9 82.5,6.9 84,8.4 SW2.A 85.4,9.4 v86,10
  Top 0.508: v42,69 v42,62 42,56 | v42,48 42,56 | v40,56 42,56 | 91,31 91,25.4 v89.5,23.9 89.5,20 89.5,19.5 | 91,31 v91,44 | v90,31 91,31 | v26,17 v26,11 | C4.2 68.5,7.4 | 68.5,7.4 69.9,7.4 70,7.5 | v68.5,9.5 68.5,7.4 | 89.5,19.5 89.5,16.5 v90,16 | v88,18 89.5,19.5
  Bottom 0.152: 40,62.5 U$1.9 | 40,68.5 U$1.4 | 36,56 C1.2 | 19.5,4 C3.2 | 23,10.5 U$3.9 23.5,11 24,11 | 23.5,17 U$3.4 | 87.5,24 U$2.9 | 87.5,30 U$2.4 | 83,17 C2.2
  Bottom 0.254: v86,10 86,12
  Bottom 0.508: DATA.2 91,45.16 | 91,45.16 44.84,45.16 v42,48 | U$1.4 41.77,68.77 v42,69 | U$1.9 41.59,62.41 v42,62 | C1.2 v40,56 | U$2.9 89.42,23.82 v89.5,23.9 | v91,44 91,45.16 | U$2.4 89.17,30.18 v90,31 | U$3.4 25.82,17.18 v26,17 | v26,11 25.82,10.82 U$3.9 20.93,10.82 19.4,9.3 C3.2 68,4 | 68,4 78,4 86,12 v90,16 | 68,4 68.5,4.5 v68.5,9.5 | C2.2 87,17 v88,18
LOAD  (via drill 0.35)
  Top 0.152: v96,49 95.5,48.5 95.5,39.5 97,38 DATA.5
  Bottom 0.15: U$1.12 41.2,58.6 41.6,59
  Bottom 0.152: U$3.12 23.5,7 24,7.5 43,7.5 52,16.5 76.1,16.5 79.6,20 87,20 U$2.12 87.5,20 92,24.5 94,24.5 95.5,26 95.5,37.5 97,37.5 DATA.5 | 41.6,59 86,59 v96,49
N$1  (via drill 0.35)
  Top 0.152: 21,98 11.5,98 v10.5,97 6,92.5 LED1.A | 21,98 21,93.5 22,92.5 LED3.A | v13.5,94 13.5,93 14,92.5 LED2.A | v29.5,94 29.5,93 30,92.5 LED4.A | 21,98 34.5,98 | 34.5,98 38,98 39,97 39,93.5 38,92.5 LED5.A | v45.5,94 45.5,93 46,92.5 LED6.A | v53.5,94 53.5,93 54,92.5 LED7.A | v56.5,92.5 62,92.5 LED8.A | v34.3,59.5 34.5,59.7 34.5,98
  Bottom 0.152: v10.5,97 v13.5,94 v29.5,94 v45.5,94 v53.5,94 55,94 v56.5,92.5 | v34.3,59.5 30.5,59.5 30,60 U$1.14
N$2  (via drill 0.35)
  Top 0.152: v12,68.5 6,68.5 LED25.A | v14,70 LED26.A | v22,70 LED27.A | v31.5,70 30,68.5 LED28.A | v37.5,66.5 37.5,67.5 38,68 LED29.A 38,68.5 44.5,75 44.5,96.5 45,97 53,97 | 53,97 52.5,96.5 52.5,75 46,68.5 LED30.A | 55.5,97 53,97 | 55.5,97 55.5,70 54,68.5 LED31.A | 55.5,97 63,97 63.5,96.5 63.5,70 62,68.5 LED32.A
  Bottom 0.15: U$1.23 30.2,71.31 31.45,70.05
  Bottom 0.152: 13.5,70 15,71.5 22,71.5 | 13.5,70 v12,68.5 | 22,71.5 29.5,71.5 U$1.23 | 13.5,70 v14,70 | 22,71.5 v22,70 | 31.45,70.05 v31.5,70 34,70 v37.5,66.5
N$3  (via drill 0.35)
  Top 0.152: LED11.A 22,84.5 28.5,91 28.5,96.5 29,97 31.5,97 v31.5,86 30,84.5 LED12.A | v35.5,84.5 38,84.5 LED13.A | v45.5,86 45.5,85 46,84.5 LED14.A | v53.5,86 53.5,85 54,84.5 LED15.A | v56.5,84.5 62,84.5 LED16.A | 15,75 16.5,76.5 v16.5,86 16.5,97.5 13,97.5 12,96.5 12,90.5 6,84.5 LED9.A | 15,75 13,75 13,77.5 14,78.5 15,78.5 15,83 14,84 LED10.A | v20,62.5 15,67.5 15,75
  Bottom 0.152: v56.5,84.5 55,86 v53.5,86 v45.5,86 44,84.5 v35.5,84.5 34,86 v31.5,86 v16.5,86 | v20,62.5 29.5,62.5 U$1.16
N$4  (via drill 0.35)
  Top 0.152: LED17.A 6,76.5 12.5,83 12.5,96.5 13,97 15.5,97 v15.5,78 14,76.5 LED18.A | v28,68.5 28,76 22,76 LED19.A | 32,74 32.5,73.5 v32.5,67.5 | 32,74 30,76 LED20.A | v38,74.5 LED21.A | 32,74 v32.5,74.5 | v45,74.5 45,75 46,76 LED22.A | v53,74.5 53,75 54,76 LED23.A | v56.5,76 62,76 LED24.A
  Bottom 0.152: v28,68.5 29,67.5 29.5,67.5 U$1.20 30,67.5 v32.5,67.5 | v56.5,76 55,74.5 v53,74.5 v45,74.5 v38,74.5 v32.5,74.5 19,74.5 v15.5,78
N$5  (via drill 0.35)
  Top 0.152: v35.5,66 35.5,63 38,60.5 LED37.A v38,58 | v52,60.5 46,60.5 LED38.A v46,58 | 54,60.5 v54,62 | 54,60.5 62,60.5 LED40.A | 54,60.5 LED39.A | v10.5,60.5 6,60.5 LED33.A | v13.5,62 14,61.5 LED34.A 14,60 14.5,59.5 v14.5,58.5 | LED36.A 30,60.5 27,63.5 27,71.5 26,71.5 24,69.5 24,62.5 22,60.5 LED35.A v22,58.5
  Bottom 0.152: v35.5,66 33,68.5 30,68.5 U$1.21 | v52,60.5 53.5,62 v54,62 | v10.5,60.5 12,62 v13.5,62 | v14.5,58.5 v22,58.5 22.5,58 v38,58 v46,58
N$6  (via drill 0.35)
  Top 0.152: v11.5,60 11.5,58 6,52.5 LED41.A | v15.5,61 15.5,54 14,52.5 LED42.A | 23.5,54 22,52.5 LED43.A | v23.5,61 23.5,54 | LED44.A 30,52 31,51 v31,50.5 31,46.5 30,45.5 29,45.5 29,43 34,38 63.5,38 63.5,50.5 62,52 LED48.A | v38,50.5 LED45.A | v46,50.5 LED46.A | v54,50.5 LED47.A | v24,54 23.5,54
  Bottom 0.152: v11.5,60 12.5,61 v15.5,61 v23.5,61 29.5,61 U$1.15 | v54,50.5 v46,50.5 v38,50.5 v31,50.5 27.5,50.5 v24,54
N$7  (via drill 0.35)
  Top 0.152: 15,38.5 15,43 14,44 LED50.A | 15,38.5 15,37.5 12.5,37.5 6,44 LED49.A | 15,38.5 23,38.5 23,43 22,44 LED51.A 22,44.5 25,47.5 v25,63.5 | 33,44 36.5,44 36.5,39 37,38.5 39,38.5 | 33,44 30,44 LED52.A | 39,38.5 39,43 38,44 LED53.A | 47,38.5 47,43 46,44 LED54.A | 39,38.5 47,38.5 | 55,38.5 55,43 54,44 LED55.A | 47,38.5 55,38.5 | 55,38.5 63,38.5 63,43 62,44 LED56.A | 33,44 v33,63
  Bottom 0.15: U$1.17 32.31,63.69 v33,63
  Bottom 0.152: v25,63.5 29.5,63.5 U$1.17
N$8  (via drill 0.35)
  Top 0.152: 14,36.5 6,36.5 LED57.A | 14,36.5 22,36.5 | 14,36.5 LED58.A | 22,36.5 26,36.5 | 26,36.5 30,36.5 | 22,36.5 LED59.A | 30,36.5 38,36.5 | 30,36.5 LED60.A | 38,36.5 46,36.5 | 38,36.5 LED61.A | 46,36.5 54,36.5 | 46,36.5 LED62.A | 54,36.5 62,36.5 LED64.A | 54,36.5 LED63.A | 26,36.5 v26,70.5
  Bottom 0.15: U$1.22 27.66,70.03 27.2,70.5
  Bottom 0.152: 27.2,70.5 v26,70.5
N$9  (via drill 0.35)
  Top 0.152: 5,46.5 5,41 6,40 LED57.C | 5,46.5 6,47.5 LED49.C | 5,54.5 6,55.5 LED41.C | 5,46.5 5,54.5 | 5,62.5 6,63.5 LED33.C | 5,54.5 5,62.5 | 5,70.5 6,71.5 LED25.C 6,72 v7.5,72 | 5,62.5 5,70.5 | 5,78.5 6,79.5 LED17.C | 5,70.5 5,78.5 | 5,86.5 6,87.5 LED9.C | 5,78.5 5,86.5 | 5,86.5 5,94.5 6,95.5 LED1.C
  Bottom 0.15: U$1.2 34.8,71.31 34.1,72
  Bottom 0.152: 34.1,72 v7.5,72
N$10
  Bottom 0.152: R1.2 26,66 27,65 29.5,65 U$1.18
N$11  (via drill 0.35)
  Top 0.152: LED72.A 94,84.5 93,85.5 93,91 94,92 LED68.A 94,92.5 95,93.5 95,97 87,97 | v78,86 LED70.A | v78,90.5 LED66.A 78,92.5 81,95.5 | LED71.A 86,84.5 85,85.5 85,91 86,92 LED67.A 86,92.5 87,93.5 87,97 | 81,95.5 84,98.5 87,98.5 87,97 | 69,91 69,85.5 70,84.5 LED69.A | 69,91 70,92 LED65.A | v72.9,21 72.5,21.4 72.5,29 73,29.5 73,87 71,89 | 69,91 71,89 | 81,95.5 78.5,98 71,98 71,89
  Bottom 0.152: v78,90.5 v78,86 | v72.9,21 76.5,21 U$2.14
N$12  (via drill 0.35)
  Top 0.152: 93,74.5 93,75 94,76 LED76.A | 93,74.5 93,69.5 94,68.5 LED80.A | 85,74.5 85,75 86,76 LED75.A | 85,74.5 85,69.5 86,68.5 LED79.A | 69,74.5 69,75 70,76 LED73.A | 69,74.5 69,69.5 70,68.5 LED77.A | 77,74.5 77,75 78,76 LED74.A 78,76.5 79,77.5 79,81 77,83 77,89 79,89 82.5,85.5 v82.5,23.5 | 77,74.5 77,69.5 78,68.5 LED78.A | v70,74.5 69,74.5 | 77,74.5 v77.5,74.5 | v85.5,74.5 85,74.5 | v93.5,74.5 93,74.5
  Bottom 0.152: v82.5,23.5 77,23.5 U$2.16 | v70,74.5 v77.5,74.5 v85.5,74.5 v93.5,74.5
N$13  (via drill 0.35)
  Top 0.152: LED84.A 94,60 93,59 93,53.5 94,52.5 LED88.A 94,52 93.5,51.5 v93.5,50.5 | LED83.A 86,60 85,59 85,53.5 86,52.5 LED87.A 86,52 85.5,51.5 v85.5,50.5 | LED81.A 70,60 69,59 69,53.5 70,52.5 LED85.A v70,50.5 | LED82.A 78,60 77,59 77,53.5 78,52.5 LED86.A 78,51 v78.5,50.5 | v81,29 80.5,29.5 v80.5,48.5
  Bottom 0.152: v81,29 77,29 U$2.20 | v70,50.5 v78.5,50.5 v80.5,48.5 83.5,48.5 v85.5,50.5 v93.5,50.5
N$14  (via drill 0.35)
  Top 0.152: v86,38 LED95.A | LED91.A v86,42 | 93,38 93,43 94,44 LED92.A | 93,38 93,37.5 94,36.5 LED96.A | 93,38 v93.5,38 | LED89.A 70,44 69,43 69,37.5 70,36.5 LED93.A 70,36 70.5,35.5 v70.5,34 | 77,41.5 77,43 78,44 LED90.A | 77,41.5 77,37.5 78,36.5 LED94.A 78,34.5 v79,33.5 | 77,41.5 v77.5,41.5
  Bottom 0.15: v77.5,41.5 78.8,40.2 87.8,40.2 | v93.5,38 91.3,40.2 88.2,40.2 | 87.8,40.2 88.2,40.2 | v86,38 88.2,40.2 | v86,42 87.8,40.2 | v70.5,34 71.78,32.72 U$2.23 78.22,32.72 v79,33.5
N$15  (via drill 0.35)
  Top 0.15: LED100.A v94,27 | v89.1,27.5 88.4,28.2 86,28.2
  Top 0.152: v72,29.5 72,22.5 70,20.5 LED101.A | v70,30 LED97.A | 78,20.5 77,21.5 77,27 78,28 LED98.A 78,29 v79,30 | 87,14.5 95,14.5 95,19 94,20 LED104.A | 87,14.5 87,19 86,20 LED103.A 86,20.5 85,21.5 85,27 86,28 86,28.2 LED99.A | 78,20.5 82,20.5 82,21 83,22 84,22 84,19 83.5,18.5 83.5,16 85,14.5 87,14.5 | 78,20.5 LED102.A
  Bottom 0.15: v94,27 93.5,27.5 v89.1,27.5
  Bottom 0.152: v70,30 70.5,29.5 v72,29.5 72.9,30.4 76.75,30.4 U$2.21 77,30 v79,30
N$16  (via drill 0.35)
  Top 0.152: v41.5,28 38,28 LED109.A | v45.5,26.5 46,27 LED110.A | 63.5,32 63.5,30 62,28.5 LED112.A | 63.5,32 63.5,33.5 59,33.5 54,28.5 LED111.A 54,27 v53.5,26.5 | 78,12.5 75,12.5 | 75,12.5 70,12.5 | 78,12.5 86,12.5 | 78,12.5 LED106.A | 86,12.5 94,12.5 LED108.A | 86,12.5 LED107.A | 75,12.5 v75,22 | 63.5,32 68.5,32 68.5,14 70,12.5 | 70,12.5 LED105.A
  Bottom 0.152: v41.5,28 43,26.5 v45.5,26.5 v53.5,26.5 | v75,22 76,22 76.5,22.5 U$2.15
N$17  (via drill 0.35)
  Top 0.152: LED2.C 14,95.5 15,94.5 15,89 14,88 LED10.C 14,87.5 13,86.5 13,81 14,80 LED18.C 14,79.5 12.5,78 12.5,73.5 14,72 LED26.C 14,71.5 13,70.5 13,65 14,64 LED34.C 14,63.5 12.5,62 v12.5,60 13,59.5 13,54.5 | 13,46.5 13,41 14,40 LED58.C | 13,46.5 14,47.5 LED50.C | 13,54.5 14,55.5 LED42.C | 13,46.5 13,54.5
  Bottom 0.15: U$1.11 35.42,59.88 34.8,60.5
  Bottom 0.152: 34.8,60.5 24.5,60.5 24,60 v12.5,60
N$18  (via drill 0.35)
  Top 0.152: 45,6.5 44,6.5 | 44,6.5 37,6.5 37,11 38,12 LED117.A | 45,6.5 45,11 46,12 LED118.A | 44,6.5 44,28.5 43,28.5 42,27.5 42,27 39,27 37,25 37,21.5 38,20.5 LED113.A | 47.5,5.5 52,10 | 52,10 54,12 LED119.A | 47.5,5.5 45,5.5 45,6.5 | 52,10 52,25 45,25 45,21.5 46,20.5 LED114.A | 59,9 55.5,5.5 47.5,5.5 | 59,9 62,12 LED120.A | 59,25 53,25 53,21.5 54,20.5 LED115.A | 59,9 v59,24.5 59,25 | 59,25 59,33 63,33 63,30.5 62,30.5 61,29.5 61,21.5 62,20.5 LED116.A
  Bottom 0.152: v59,24.5 75,24.5 75.5,25 76.5,25 U$2.17
N$19  (via drill 0.35)
  Top 0.152: 14,28.5 6,28.5 LED125.A | 14,28.5 22,28.5 | 14,28.5 LED126.A | 22,28.5 30,28.5 LED128.A 30,28 36,22 36,6.5 38,4.5 | 22,28.5 LED127.A | 46,4.5 38,4.5 | 46,4.5 54,4.5 | 46,4.5 LED122.A | 54,4.5 62,4.5 | 54,4.5 LED123.A | v67.5,31 64,27.5 64,6.5 62,4.5 | 62,4.5 LED124.A | 38,4.5 LED121.A
  Bottom 0.15: U$2.22 67.94,31.45 v67.5,31
N$20  (via drill 0.35)
  Top 0.152: 68.5,62 68.5,49.5 70,48 LED89.C 70,47.5 68.5,46 68.5,35 v69.5,34 70,33.5 LED97.C 70,31.5 69,30.5 69,17 70,16 LED105.C | 68.5,62 70,63.5 LED81.C | 68.5,78 70,79.5 LED73.C | 68.5,62 68.5,78 | 68.5,78 68.5,94 70,95.5 LED65.C | 38.5,23 38,23.5 LED113.C | 38.5,23 39,22.5 39,9 38,8 LED121.C | v43,27.5 38.5,23
  Bottom 0.152: U$2.2 87,33 80.5,33 78.5,35 70.5,35 v69.5,34 67,31.5 47,31.5 v43,27.5
N$21  (via drill 0.35)
  Top 0.152: 47,14.5 47,22.5 46,23.5 LED114.C | 47,14.5 47,9 46,8 LED122.C | 78,16 76.5,17.5 76.5,30 | 76.5,30 78,31.5 LED98.C | 76.5,46 78,47.5 LED90.C | 76.5,30 76.5,46 | 76.5,62 78,63.5 LED82.C | 76.5,46 76.5,62 | 76.5,78 78,79.5 LED74.C | 76.5,62 76.5,78 | 76.5,78 76.5,94 78,95.5 LED66.C | 78,16 v83,21 | v51,14.5 47,14.5 | 78,16 v76.5,14.5 | 78,16 LED106.C
  Bottom 0.152: v83,21 87,21 U$2.11 | v76.5,14.5 v51,14.5
N$22  (via drill 0.35)
  Top 0.152: 84.5,78 84.5,65.5 86,64 LED83.C 86,63.5 84.5,62 84.5,49.5 86,48 LED91.C 86,47.5 85,46.5 85,30.5 | 84.5,78 86,79.5 LED75.C | 84.5,78 84.5,94 86,95.5 LED67.C | 55,15.5 55,22.5 54,23.5 LED115.C | 55,15.5 55,9 54,8 LED123.C | 85,30.5 86,31.5 LED99.C | 85,30.5 84.5,30 v84.5,27.5 v84.5,18.5 84.5,17.5 86,16 LED107.C | v56,15.5 55,15.5
  Bottom 0.152: v84.5,27.5 87,27.5 U$2.6 | v56,15.5 76,15.5 79,18.5 v84.5,18.5
N$23  (via drill 0.35)
  Top 0.152: 92.5,62 92.5,49.5 94,48 LED92.C 94,47.5 92.5,46 92.5,33.5 94,32 LED100.C 94,31.5 93,30.5 v93,26.5 93,17 94,16 LED108.C | 92.5,62 94,63.5 LED84.C | 92.5,78 94,79.5 LED76.C | 92.5,62 92.5,78 | 92.5,78 92.5,94 94,95.5 LED68.C | LED124.C 62,8 63,9 63,22.5 62,23.5 LED116.C 62,24 63,25 v63,25.5
  Bottom 0.152: v93,26.5 87.5,26.5 U$2.7 87,26.5 84.5,26.5 84,27 64.5,27 v63,25.5
N$24  (via drill 0.35)
  Top 0.152: 36.5,30 36.5,17.5 38,16 LED117.C | 36.5,30 38,31.5 LED109.C 38,32 v44.5,32 | 36.5,30 13.5,30 13,30.5 13,31.5 6,31.5 LED125.C | 71,38.5 70,39.5 LED93.C | 71,38.5 71.5,38 v71.5,36 71.5,34 71,33.5 71,25 70,24 LED101.C | 71,54.5 70,55.5 LED85.C | 71,38.5 71,54.5 | 71,70.5 70,71.5 LED77.C | 71,54.5 71,70.5 | 71,70.5 71,86.5 70,87.5 LED69.C
  Bottom 0.152: U$2.3 87.5,31.5 88.5,32.5 88.5,36 v71.5,36 70.5,36 66.5,32 v44.5,32
N$25  (via drill 0.35)
  Top 0.152: 21,46.5 21,41 22,40 LED59.C | 21,46.5 22,47.5 LED51.C | 21,54.5 22,55.5 LED43.C | 21,46.5 21,54.5 | 21,62.5 22,63.5 LED35.C | 21,54.5 21,62.5 | 21,70.5 22,71.5 LED27.C | 21,62.5 21,70.5 | 21,78.5 22,79.5 LED19.C | 21,70.5 21,78.5 | 21,78.5 21,86.5 22,87.5 LED11.C 22,88 23,89 23,94.5 22,95.5 LED3.C 22,97.5 31.5,97.5 33.5,95.5 v33.5,71
  Bottom 0.152: v33.5,71 34,71 38.5,66.5 39.5,66.5 U$1.6
N$26  (via drill 0.35)
  Top 0.152: LED118.C 46,16 44.5,17.5 44.5,30 46,31.5 LED110.C 46,33 | 46,33 37,33 36.5,32.5 36.5,30.5 21,30.5 21,31.5 14,31.5 LED126.C | 79.5,25.5 80,26 80,37.5 79.5,38 | 79.5,25.5 78,24 LED102.C | 79,38.5 78,39.5 LED94.C | 79,38.5 79.5,38 | 79,54.5 79.5,54 79.5,38 | 79,54.5 78,55.5 LED86.C | 79,54.5 79,70.5 78,71.5 LED78.C 78,72 79.5,73.5 79.5,86 78,87.5 LED70.C | 79.5,25.5 v82.5,22.5 | v52.5,33 46,33 | 79,38.5 v78.5,38
  Bottom 0.152: v82.5,22.5 87,22.5 U$2.10 | v52.5,33 57.5,38 v78.5,38
N$27  (via drill 0.35)
  Top 0.15: 89,30 89,36.5 88.75,36.75 | 88,26 89.7,26 90.3,26.6 90.3,27.7 v89,29
  Top 0.152: LED119.C 54,16 52.5,17.5 52.5,30 54,31.5 LED111.C 54,34 | 54,34 29.5,34 28.5,33 28.5,32 22,32 LED127.C | 88,26 86,24 LED103.C | v89,29 89,30 | 87,38.5 86,39.5 LED95.C | 88.75,36.75 87,38.5 | 87,54.5 86,55.5 LED87.C | 87,38.5 87,54.5 | 87,70.5 86,71.5 LED79.C | 87,54.5 87,70.5 | 87,70.5 87,86.5 86,87.5 LED71.C | v58.5,34 54,34
  Bottom 0.152: U$2.5 87.5,29 v89,29 95,29 95,30 88,37 61.5,37 v58.5,34
N$28  (via drill 0.35)
  Top 0.152: 95,38.5 95,25.5 | 95,25.5 95,25 94,24 LED104.C | 95,38.5 94,39.5 LED96.C | 95,54.5 94,55.5 LED88.C | 95,38.5 95,54.5 | 95,70.5 94,71.5 LED80.C | 95,54.5 95,70.5 | 95,70.5 95,86.5 94,87.5 LED72.C | 60.5,23.5 60.5,30 62,31.5 LED112.C | 60.5,23.5 60.5,17.5 62,16 LED120.C | v35.5,31.5 30,31.5 LED128.C | v60,23.5 60.5,23.5 | v94,25.5 95,25.5
  Bottom 0.15: U$2.8 79.09,25.09 78.5,24.5
  Bottom 0.152: v35.5,31.5 43.5,23.5 v60,23.5 74.6,23.5 75.6,24.5 78.5,24.5 | v94,25.5 93.5,25 87.5,25 U$2.8
N$29
  Bottom 0.152: R2.2 74,26 74.5,26.5 76.5,26.5 U$2.18
N$33  (via drill 0.35)
  Top 0.15: v33.1,64.9 31.4,64.9 31,64.5 | LED36.C 31,62.75 31,62.4
  Top 0.152: 29,46.5 30,47.5 LED52.C | 29,46.5 28.5,46 28.5,41.5 30,40 LED60.C | 29,46.5 29,54.5 30,55.5 LED44.C 30,56 31,57 31,62.4 31,62.6 | 29,70.5 29,65 30,64 LED36.C 30,63.5 31,64.5 | 29,70.5 30,71.5 LED28.C | 29,78.5 30,79.5 LED20.C | 29,70.5 29,78.5 | 29,78.5 29,86.5 30,87.5 LED12.C 30,88 31,89 31,94.5 30,95.5 LED4.C
  Bottom 0.152: U$1.7 39.62,64.9 v33.1,64.9
N$37  (via drill 0.35)
  Top 0.152: 12.5,20 6,20 LED180.A | 12.5,20 12.5,15 13,14.5 15,14.5 | 15,14.5 15,19 14,20 LED179.A | 23,25 23,21.5 22,20.5 LED178.A | 23,25 12.5,25 12.5,20 | 23,25 31,25 31,21.5 30,20.5 LED177.A | v15.5,12.5 15,13 15,14.5
  Bottom 0.15: U$3.17 15.1,12.1 v15.5,12.5
N$38  (via drill 0.35)
  Top 0.152: 11,12.5 14,12.5 LED187.A 14,12 13,11 13,4.5 | 11,12.5 6,12.5 LED188.A | 11,12.5 v11,17 | 14,4.5 13,4.5 | 13,4.5 6,4.5 LED192.A | 14,4.5 22,4.5 | 14,4.5 LED191.A | 22,4.5 23,4.5 | 23,4.5 29,4.5 | 29,4.5 30,4.5 LED189.A | 22,4.5 LED190.A | 23,4.5 23,11 22,12 LED186.A | 29,4.5 29,11 30,12 LED185.A
  Bottom 0.15: U$3.22 11.64,18.45 11.1,17.9 11.1,17.1 v11,17
N$39  (via drill 0.35)
  Top 0.152: 29,19.5 29,22.5 30,23.5 LED177.C | 29,19.5 29,17 30,16 LED185.C | 29,19.5 v28.5,19.5
  Bottom 0.152: v28.5,19.5 23.5,19.5 U$3.2
N$40  (via drill 0.35)
  Top 0.152: LED178.C 22,23.5 21,22.5 21,17 22,16 LED186.C 22,15.5 23.5,14 23.5,10 v25,8.5
  Bottom 0.152: v25,8.5 23.5,8.5 U$3.11
N$41  (via drill 0.35)
  Top 0.152: 37,46.5 37,41 38,40 LED61.C | 37,46.5 38,47.5 LED53.C | 37,46.5 37,54.5 38,55.5 LED45.C 38,56 39,57 39,62.5 38,63.5 LED37.C 38,64 36.5,65.5 36.5,69 38,70.5 | LED5.C 38,95.5 37,94.5 37,89 38,88 LED13.C 38,87.5 39,86.5 39,81 38,80 LED21.C 38,79.5 37,78.5 37,73 38,72 LED29.C 38,70.5 | 38,70.5 v38,70
  Bottom 0.152: v38,70 39.5,70 U$1.3
N$42  (via drill 0.35)
  Top 0.152: 13.5,23 14,23.5 LED179.C | 13.5,23 13,22.5 13,17 14,16 LED187.C | v15.5,19.5 15,20 15,21.5 13.5,23
  Bottom 0.152: v15.5,19.5 20.5,14.5 23,14.5 U$3.6
N$43  (via drill 0.35)
  Top 0.152: LED180.C 6,23.5 5,22.5 5,17 6,16 LED188.C 6,15.5 v7.5,14
  Bottom 0.15: U$3.7 15.34,13.37 14.7,14
  Bottom 0.152: 14.7,14 v7.5,14
N$44  (via drill 0.35)
  Top 0.152: v31,17.5 31,9 30,8 LED189.C
  Bottom 0.152: v31,17.5 30,18.5 23.5,18.5 U$3.3
N$45  (via drill 0.35)
  Top 0.152: v21,9.5 21,9 22,8 LED190.C
  Bottom 0.152: v21,9.5 23,9.5 U$3.10
N$46  (via drill 0.35)
  Top 0.152: v20.5,15.5 20.5,14.5 14,8 LED191.C
  Bottom 0.152: v20.5,15.5 21,16 23,16 U$3.5
N$47  (via drill 0.35)
  Top 0.152: v8,8 6,8 LED192.C
  Bottom 0.15: U$3.8 16.5,12.1 15.9,11.5
  Bottom 0.152: v8,8 11.5,11.5 15.9,11.5
N$48
  Bottom 0.152: 8,13 R3.2 | 12.5,13.5 U$3.18
  Bottom 0.508: U$3.18 8.79,13.37 R3.2
N$49  (via drill 0.35)
  Top 0.152: 47,86.5 47,81 46,80 LED22.C 46,79.5 47,78.5 47,73 46,72 LED30.C 46,71.5 45,70.5 45,62.5 | 47,86.5 46,87.5 LED14.C | 47,86.5 47,94.5 46,95.5 LED6.C | 45,46.5 45,41 46,40 LED62.C | 45,46.5 46,47.5 LED54.C | 45,54.5 46,55.5 LED46.C | 45,46.5 45,54.5 | 45,62.5 46,63.5 LED38.C | 45,54.5 45,61 | 45,61 45,62.5 | 45,61 v44.5,61
  Bottom 0.152: v44.5,61 40,61 U$1.10
N$57  (via drill 0.35)
  Top 0.152: 55,86.5 55,81 54,80 LED23.C 54,79.5 55,78.5 55,73 54,72 LED31.C 54,71.5 53,70.5 53,67.5 | 55,86.5 54,87.5 LED15.C | 55,86.5 55,94.5 54,95.5 LED7.C | 53,46.5 53,41 54,40 LED63.C | 53,46.5 54,47.5 LED55.C | 53,54.5 54,55.5 LED47.C | 53,46.5 53,54.5 | 53,62.5 54,63.5 LED39.C | 53,54.5 53,62.5 | 53,62.5 53,67.5 | 53,67.5 v52.5,67.5
  Bottom 0.152: v52.5,67.5 40,67.5 U$1.5
N$65  (via drill 0.35)
  Top 0.152: 63,78.5 63,73 62,72 LED32.C 62,71.5 61,70.5 61,64 | 63,78.5 62,79.5 LED24.C | 63,86.5 62,87.5 LED16.C | 63,78.5 63,86.5 | 63,86.5 63,94.5 62,95.5 LED8.C | 61,46.5 61,41 62,40 LED64.C | 61,46.5 62,47.5 LED56.C | 61,46.5 61,54.5 62,55.5 LED48.C 62,56 63,57 63,62.5 62,63.5 LED40.C 62,64 61,64 | 61,64 v60,64
  Bottom 0.152: v60,64 40,64 U$1.8

### Text on the board
bPlace: +5V | GND | CLK | DATA | LOAD | BTN0 | BTN1